# EAGLE schematic drum_circuits (EAGLE 7.6.0)
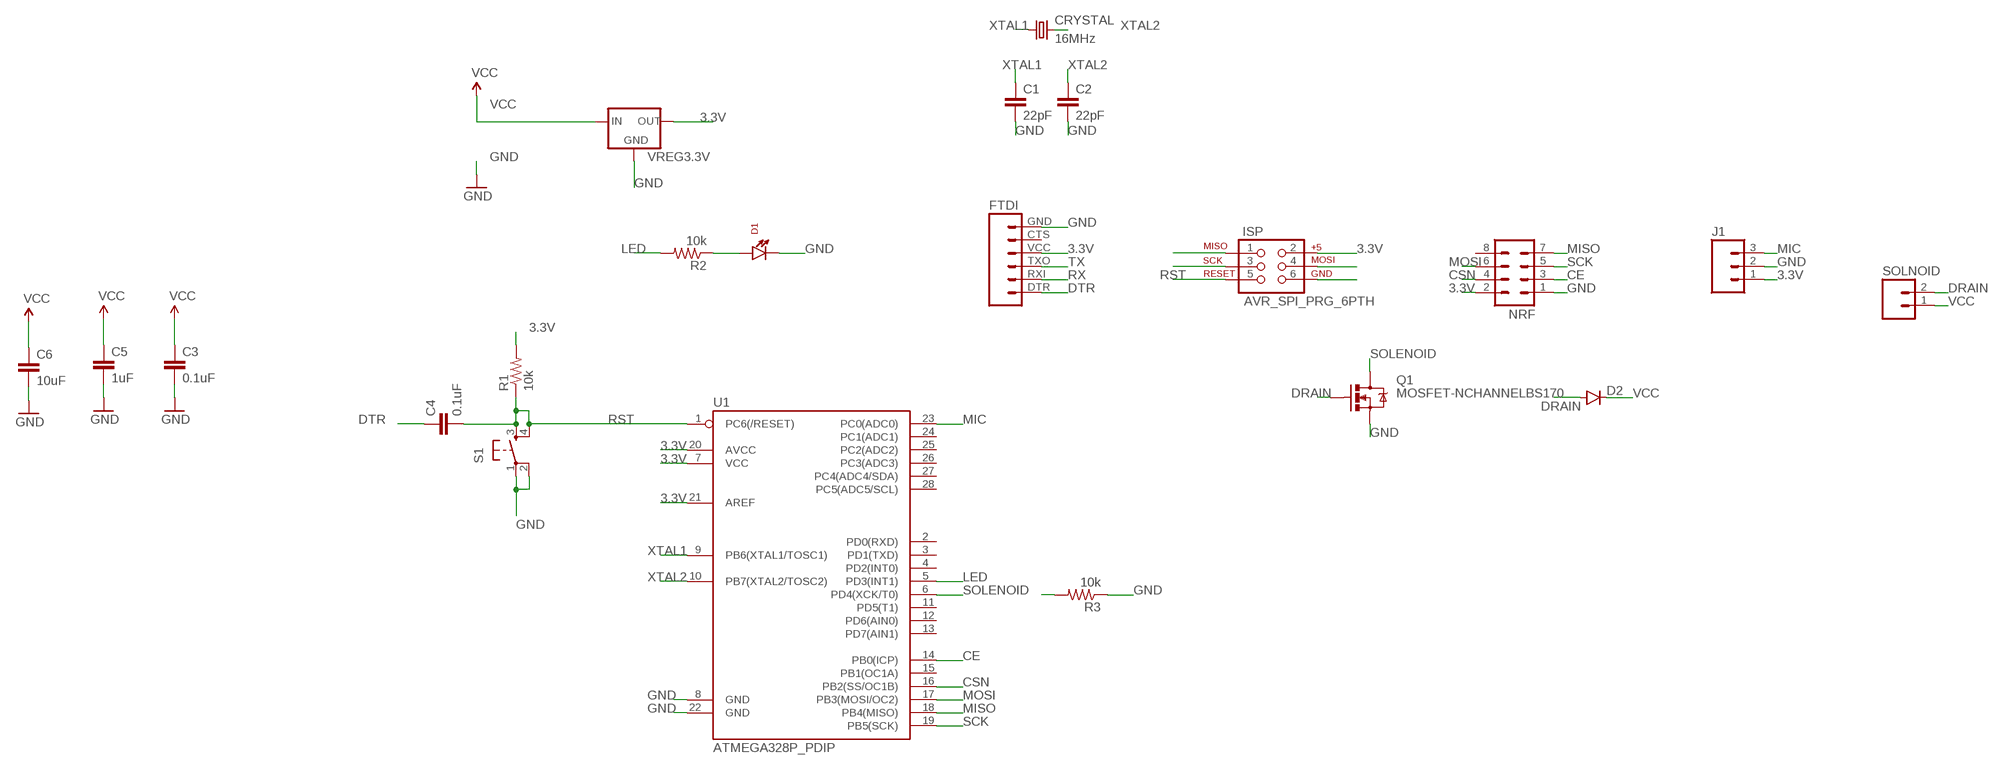
[diagram p0: schematic, sheet 1]

## Parts
C1  22pF  CAPPTH2  [CAP-PTH-SMALL2]
C2  22pF  CAPPTH2  [CAP-PTH-SMALL2]
C3  0.1uF  CAPPTH  [CAP-PTH-SMALL]
C4  0.1uF  CAPPTH  [CAP-PTH-SMALL]
C5  1uF  CAPPTH  [CAP-PTH-SMALL]
C6  10uF  CAPPTH  [CAP-PTH-SMALL]
CRYSTAL  16MHz  CRYSTALHC49US  [HC49US]
D1  LTE-302  [LTE-302]
D2  DIODEKIT2  [DIODE-1N4001-KIT]
FTDI  FTDI_BASICPTH  [FTDI_BASIC]
ISP  AVR_SPI_PRG_6PTH  [2X3]
J1  M03PTH  [1X03]
NRF  M04X2  [2X4]
Q1  MOSFET-NCHANNELBS170  [TO-92]
R1  10k  10KOHM-1/4W-1%(PTH)HORIZ-KIT  [AXIAL-0.3EZ]
R2  10k  10KOHM-1/4W-1%(PTH)HORIZ-KIT  [AXIAL-0.3EZ]
R3  10k  10KOHM-1/4W-1%(PTH)HORIZ-KIT  [AXIAL-0.3EZ]
S1  TAC_SWITCHPTH  [TACTILE-PTH]
SOLNOID  M02PTH  [1X02]
U1  ATMEGA328P_PDIP  [DIL28-3]
VREG3.3V  V_REG_78XX-TO-220  [TO-220-ALT]

## Nets
3.3V: FTDI.VCC ISP.2 J1.1 NRF.2 R1.P$2 U1.7(VCC) U1.20(AVCC) U1.21(AREF) VREG3.3V.OUT
CE: NRF.3 U1.14(PB0(ICP))
CSN: NRF.4 U1.16(PB2(SS/OC1B))
DRAIN: D2.A Q1.2(G) SOLNOID.2
DTR: C4.1 FTDI.DTR
GND: C1.2 C2.2 C3.2 C5.2 C6.2 D1.C FTDI.GND ISP.6 J1.2 NRF.1 Q1.3(S) R3.P$1 S1.1 S1.2 U1.8(GND) U1.22(GND) VREG3.3V.GND
LED: R2.P$2 U1.5(PD3(INT1))
MIC: J1.3 U1.23(PC0(ADC0))
MISO: ISP.1 NRF.7 U1.18(PB4(MISO))
MOSI: ISP.4 NRF.6 U1.17(PB3(MOSI/OC2))
N$1: D1.A R2.P$1
RST: C4.2 ISP.5 R1.P$1 S1.3 S1.4 U1.1(PC6(/RESET))
RX: FTDI.RXI
SCK: ISP.3 NRF.5 U1.19(PB5(SCK))
SOLENOID: Q1.1(D) R3.P$2 U1.6(PD4(XCK/T0))
TX: FTDI.TXO
VCC: C3.1 C5.1 C6.1 D2.C SOLNOID.1 VREG3.3V.IN
XTAL1: C1.1 CRYSTAL.1 U1.9(PB6(XTAL1/TOSC1))
XTAL2: C2.1 CRYSTAL.2 U1.10(PB7(XTAL2/TOSC2))
Unconnected: FTDI.CTS NRF.8 U1.2(PD0(RXD)) U1.3(PD1(TXD)) U1.4(PD2(INT0)) U1.11(PD5(T1)) U1.12(PD6(AIN0)) U1.13(PD7(AIN1)) U1.15(PB1(OC1A)) U1.24(PC1(ADC1)) U1.25(PC2(ADC2)) U1.26(PC3(ADC3)) U1.27(PC4(ADC4/SDA)) U1.28(PC5(ADC5/SCL))

## Library data of the parts
C1 C2 = SparkFun-Capacitors:CAP: Capacitor Standard 0603 ceramic capacitor, and 0.1" leaded capacitor.
C3-C6 = SparkFun-Passives:CAP: Capacitor Standard 0603 ceramic capacitor, and 0.1" leaded capacitor.
CRYSTAL = SparkFun-FreqCtrl:CRYSTAL: Various standard crystals. Proven footprints.
D1 = SparkFun-LED:LTE-302: Through-hole side-firing 940nm IR LED
D2 = SparkFun-DiscreteSemi:DIODE: Diode These are standard reverse protection diodes and small signal diodes. SMA package can handle up to about 1A. SOD-323 can handle about 200mA. What the SOD-323 package when ordering, there are some mfgs out there that are 5-pin packages.
FTDI = SparkFun-Connectors:FTDI_BASIC: FTDI Basic header with labels
ISP = SparkFun-Connectors:AVR_SPI_PRG_6: AVR ISP 6 Pin This is the reduced ISP connector for AVR programming. Common on Arduino. This footprint will take up less PCB space and can be used with a 10-pin to 6-pin adapter such as SKU: BOB-08508 **Special note about "TEST_POINT" package. The stop mask is on the top side, so if you want your programming test points to be on the bottom of your board, make sure to place this package on the bottom side of the board. This also ensure that the orientation to program from the bottom side will be correct.
J1 = SparkFun-Connectors:M03: Header 3 Standard 3-pin 0.1" header. Use with straight break away headers (SKU : PRT-00116), right angle break away headers (PRT-00553), swiss pins (PRT-00743), machine pins (PRT-00117), and female headers (PRT-00115). Molex polarized connector foot print use with SKU : PRT-08232 with associated crimp pins and housings.
NRF = SparkFun-Connectors:M04X2: .1" header, two rows of four.
Q1 = SparkFun-DiscreteSemi:MOSFET-NCHANNEL: Common NMOSFET Parts MFG P/N Store ID Prod ID FDD8780 TRANS-09984 SI7820DN TRANS-11055 FDS6630A IC-08089 2N7002PW TRANS-11151 FQP30N06L COM-10213 TRANS-10060 BSS123LT1G TRANS-08345 BSS138 TRANS-00830 BS170 2N7000
R1-R3 = SparkFun-Resistors:10KOHM-1/4W-1%(PTH): RES-12183; PROD_ID: RES-12183
S1 = SparkFun-Retired:TAC_SWITCH: Momentary Switch Button commonly used for reset or general input. Spark Fun Electronics SKU : COM-00097 SMT- SWCH-08247
SOLNOID = SparkFun-Connectors:M02: Standard 2-pin 0.1" header. Use with - straight break away headers ( PRT-00116) - right angle break away headers (PRT-00553) - swiss pins (PRT-00743) - machine pins (PRT-00117) - female headers (PRT-00115) Molex polarized connector foot print use with: PRT-08233 with associated crimp pins and housings. 2.54_SCREWTERM for use with PRT-10571. 3.5mm Screw Terminal footprints for PRT-08084 5mm Screw Terminal footprints for use with PRT-08432
U1 = SparkFun-DigitalIC:ATMEGA328P_PDIP: uC used in the Arduino 32kb flash, 1k EEPROM, 2k SRAM This is the through-hole version of this chip.
VREG3.3V = SparkFun-PowerIC:V_REG_78XX: Voltage Regulator Standard 78xx regulator. IGO (Input Ground Output). Spark Fun Electronics SKU : COM-00107; PROD_ID: VREG-08450; SF_ID: COM-00107